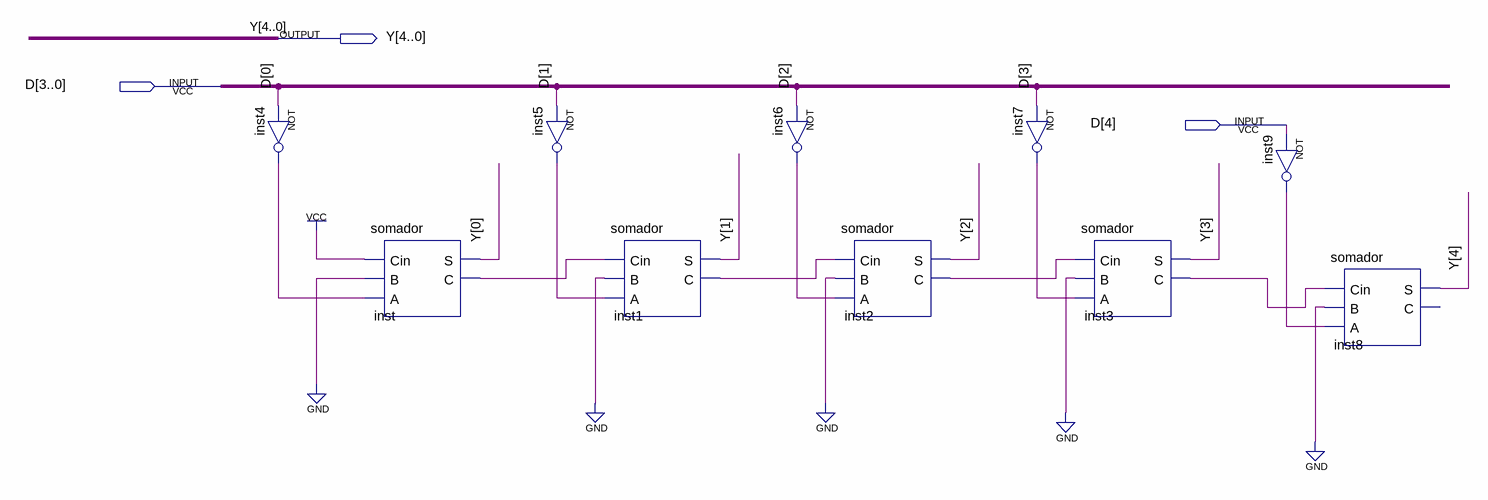
[diagram p0: schematic sheet]
// Quartus schematic complementado2.bdf as structural Verilog: 10 symbols, 3 pins
module complementado2 (
  input  [4:0] D,
  output [4:0] Y
);

  wire inst1_c, inst2_c, inst3_c, inst4_out, inst5_out, inst6_out, inst7_out, inst9_out, inst_c;

  not inst4 (inst4_out, D[0]);
  somador inst (.Cin(1'b1), .B(1'b0), .A(inst4_out), .S(Y[0]), .C(inst_c));
  not inst5 (inst5_out, D[1]);
  somador inst1 (.Cin(inst_c), .B(1'b0), .A(inst5_out), .S(Y[1]), .C(inst1_c));
  not inst6 (inst6_out, D[2]);
  somador inst2 (.Cin(inst1_c), .B(1'b0), .A(inst6_out), .S(Y[2]), .C(inst2_c));
  not inst7 (inst7_out, D[3]);
  somador inst3 (.Cin(inst2_c), .B(1'b0), .A(inst7_out), .S(Y[3]), .C(inst3_c));
  not inst9 (inst9_out, D[4]);
  somador inst8 (.Cin(inst3_c), .B(1'b0), .A(inst9_out), .S(Y[4]));  // open: C
endmodule
